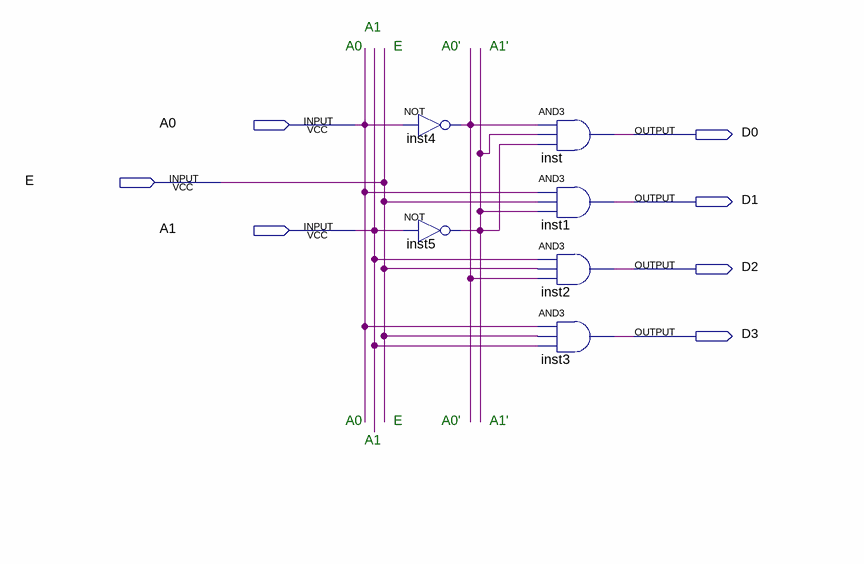
[diagram p0: schematic sheet]
// Quartus schematic Decoder_2to4.bdf as structural Verilog: 6 symbols, 7 pins
module Decoder_2to4 (
  input  A0,
  input  E,
  input  A1,
  output D0,
  output D1,
  output D2,
  output D3
);

  wire inst4_out, inst5_out;

  not inst4 (inst4_out, A0);
  not inst5 (inst5_out, A1);
  and inst (D0, inst4_out, inst5_out, inst5_out);
  and inst1 (D1, A0, E, inst5_out);
  and inst2 (D2, A1, E, inst4_out);
  and inst3 (D3, A0, E, A1);

  // Notes on the sheet:
  //   A1
  //   A0
  //   E
  //   A0'
  //   A1'
  //   A0
  //   E
  //   A0'
  //   A1'
  //   A1
endmodule
